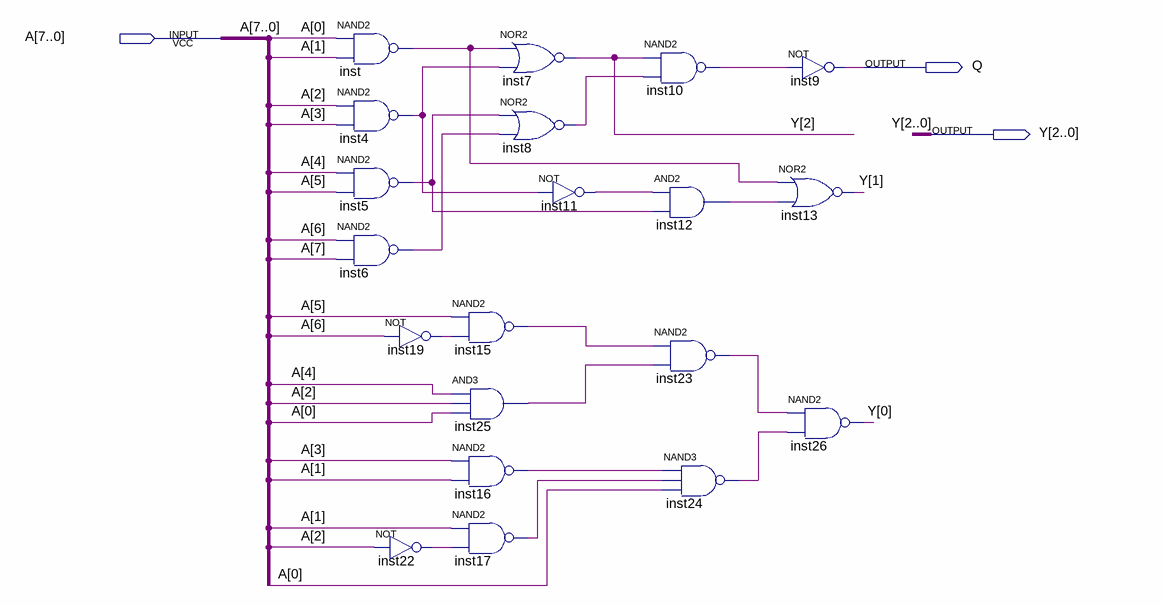
[diagram p0: schematic sheet]
// Quartus schematic Bound_Nibb_Enc.bdf as structural Verilog: 20 symbols, 3 pins
module Bound_Nibb_Enc (
  input  [7:0] A,
  output Q,
  output [2:0] Y
);

  wire inst4_out, inst5_out, inst6_out, inst8_out, inst10_out, inst11_out, inst12_out, inst15_out,
       inst16_out, inst17_out, inst19_out, inst22_out, inst23_out, inst24_out, inst25_out, inst_out;

  nand inst (inst_out, A[0], A[1]);
  nand inst4 (inst4_out, A[2], A[3]);
  nand inst5 (inst5_out, A[4], A[5]);
  nand inst6 (inst6_out, A[6], A[7]);
  not inst19 (inst19_out, A[6]);
  not inst22 (inst22_out, A[2]);
  nor inst7 (Y[2], inst_out, inst4_out);
  nor inst8 (inst8_out, inst5_out, inst6_out);
  nand inst15 (inst15_out, A[5], inst19_out);
  and inst25 (inst25_out, A[4], A[2], A[0]);
  nand inst16 (inst16_out, A[3], A[1]);
  nand inst17 (inst17_out, A[1], inst22_out);
  not inst11 (inst11_out, inst4_out);
  nand inst10 (inst10_out, Y[2], inst8_out);
  and inst12 (inst12_out, inst11_out, inst5_out);
  nand inst23 (inst23_out, inst15_out, inst25_out);
  nand inst24 (inst24_out, inst16_out, inst17_out, A[0]);
  not inst9 (Q, inst10_out);
  nor inst13 (Y[1], inst_out, inst12_out);
  nand inst26 (Y[0], inst23_out, inst24_out);
endmodule
